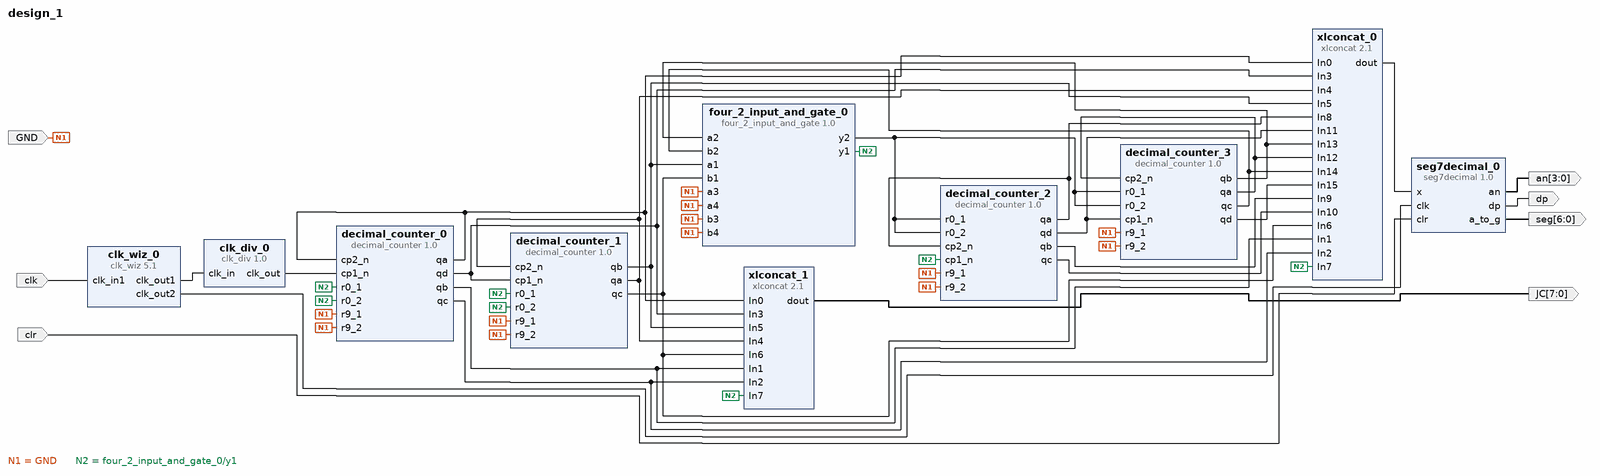
[diagram p0: block diagram of the top level]
# Vivado block design design_1, Vivado 2014.4
create_bd_design design_1

create_bd_port -dir I -type clk clk
set_property -dict {CONFIG.FREQ_HZ 100000000 CONFIG.PHASE 0.000} [get_bd_ports clk]
create_bd_port -dir I GND
create_bd_port -dir I clr
create_bd_port -dir O dp
create_bd_port -dir O -from 3 -to 0 an
create_bd_port -dir O -from 6 -to 0 seg
create_bd_port -dir O -from 7 -to 0 JC

create_bd_cell -type ip -vlnv xilinx.com:XUP:decimal_counter:1.0 decimal_counter_0
create_bd_cell -type ip -vlnv xilinx.com:XUP:decimal_counter:1.0 decimal_counter_1
create_bd_cell -type ip -vlnv xilinx.com:XUP:decimal_counter:1.0 decimal_counter_2
create_bd_cell -type ip -vlnv xilinx.com:XUP:decimal_counter:1.0 decimal_counter_3
create_bd_cell -type ip -vlnv xilinx.com:xup:clk_div:1.0 clk_div_0
create_bd_cell -type ip -vlnv xilinx.com:XUP:four_2_input_and_gate:1.0 four_2_input_and_gate_0
create_bd_cell -type ip -vlnv xilinx.com:xup:seg7decimal:1.0 seg7decimal_0
create_bd_cell -type ip -vlnv xilinx.com:ip:clk_wiz:5.1 clk_wiz_0
set_property -dict {CONFIG.CLKOUT2_USED true CONFIG.USE_LOCKED false CONFIG.USE_RESET false} [get_bd_cells clk_wiz_0]
create_bd_cell -type ip -vlnv xilinx.com:ip:xlconcat:2.1 xlconcat_0
set_property -dict {CONFIG.NUM_PORTS 16} [get_bd_cells xlconcat_0]
create_bd_cell -type ip -vlnv xilinx.com:ip:xlconcat:2.1 xlconcat_1
set_property -dict {CONFIG.NUM_PORTS 8} [get_bd_cells xlconcat_1]

# ---- connections ----

connect_bd_net [get_bd_pins clk_div_0/clk_out] [get_bd_pins decimal_counter_0/cp1_n]
connect_bd_net [get_bd_pins decimal_counter_0/qa] [get_bd_pins decimal_counter_0/cp2_n] [get_bd_pins xlconcat_0/In0] [get_bd_pins xlconcat_1/In0]
connect_bd_net -net clock_rtl_1 [get_bd_ports clk] [get_bd_pins clk_wiz_0/clk_in1]
connect_bd_net [get_bd_pins clk_wiz_0/clk_out1] [get_bd_pins clk_div_0/clk_in]
connect_bd_net [get_bd_pins decimal_counter_0/qd] [get_bd_pins decimal_counter_1/cp1_n] [get_bd_pins xlconcat_0/In3] [get_bd_pins xlconcat_1/In3]
connect_bd_net [get_bd_pins decimal_counter_1/qa] [get_bd_pins decimal_counter_1/cp2_n] [get_bd_pins xlconcat_0/In4] [get_bd_pins xlconcat_1/In4]
connect_bd_net [get_bd_ports GND] \
  [get_bd_pins decimal_counter_0/r9_1] [get_bd_pins decimal_counter_0/r9_2] [get_bd_pins decimal_counter_1/r9_1] \
  [get_bd_pins decimal_counter_1/r9_2] [get_bd_pins decimal_counter_2/r9_1] [get_bd_pins decimal_counter_2/r9_2] \
  [get_bd_pins decimal_counter_3/r9_1] [get_bd_pins decimal_counter_3/r9_2] [get_bd_pins four_2_input_and_gate_0/b4] \
  [get_bd_pins four_2_input_and_gate_0/b3] [get_bd_pins four_2_input_and_gate_0/a3] [get_bd_pins four_2_input_and_gate_0/a4]
connect_bd_net [get_bd_pins decimal_counter_2/qa] [get_bd_pins decimal_counter_2/cp2_n] [get_bd_pins xlconcat_0/In8]
connect_bd_net [get_bd_pins four_2_input_and_gate_0/y2] \
  [get_bd_pins decimal_counter_2/r0_1] [get_bd_pins decimal_counter_2/r0_2] [get_bd_pins decimal_counter_3/r0_1] \
  [get_bd_pins decimal_counter_3/r0_2]
connect_bd_net [get_bd_pins decimal_counter_3/qa] [get_bd_pins decimal_counter_3/cp2_n] [get_bd_pins xlconcat_0/In12]
connect_bd_net [get_bd_pins decimal_counter_2/qd] [get_bd_pins decimal_counter_3/cp1_n] [get_bd_pins xlconcat_0/In11]
connect_bd_net [get_bd_pins decimal_counter_1/qb] [get_bd_pins four_2_input_and_gate_0/a1] [get_bd_pins xlconcat_0/In5] [get_bd_pins xlconcat_1/In5]
connect_bd_net [get_bd_pins decimal_counter_3/qb] [get_bd_pins four_2_input_and_gate_0/a2] [get_bd_pins xlconcat_0/In13]
connect_bd_net [get_bd_pins decimal_counter_3/qc] [get_bd_pins four_2_input_and_gate_0/b2] [get_bd_pins xlconcat_0/In14]
connect_bd_net [get_bd_pins clk_wiz_0/clk_out2] [get_bd_pins seg7decimal_0/clk]
connect_bd_net [get_bd_ports clr] [get_bd_pins seg7decimal_0/clr]
connect_bd_net [get_bd_pins xlconcat_0/dout] [get_bd_pins seg7decimal_0/x]
connect_bd_net [get_bd_pins seg7decimal_0/dp] [get_bd_ports dp]
connect_bd_net [get_bd_pins seg7decimal_0/an] [get_bd_ports an]
connect_bd_net [get_bd_pins seg7decimal_0/a_to_g] [get_bd_ports seg]
connect_bd_net [get_bd_pins decimal_counter_0/qb] [get_bd_pins xlconcat_0/In1] [get_bd_pins xlconcat_1/In1]
connect_bd_net [get_bd_pins decimal_counter_0/qc] [get_bd_pins xlconcat_0/In2] [get_bd_pins xlconcat_1/In2]
connect_bd_net -net decimal_counter_1_qd [get_bd_pins four_2_input_and_gate_0/y1] \
  [get_bd_pins xlconcat_0/In7] [get_bd_pins xlconcat_1/In7] [get_bd_pins decimal_counter_0/r0_1] \
  [get_bd_pins decimal_counter_0/r0_2] [get_bd_pins decimal_counter_1/r0_1] [get_bd_pins decimal_counter_1/r0_2] \
  [get_bd_pins decimal_counter_2/cp1_n]
connect_bd_net [get_bd_pins decimal_counter_2/qb] [get_bd_pins xlconcat_0/In9]
connect_bd_net [get_bd_pins decimal_counter_2/qc] [get_bd_pins xlconcat_0/In10]
connect_bd_net [get_bd_pins decimal_counter_3/qd] [get_bd_pins xlconcat_0/In15]
connect_bd_net [get_bd_pins xlconcat_1/dout] [get_bd_ports JC]
connect_bd_net [get_bd_pins decimal_counter_1/qc] [get_bd_pins xlconcat_0/In6] [get_bd_pins four_2_input_and_gate_0/b1] [get_bd_pins xlconcat_1/In6]

validate_bd_design
save_bd_design
